# EAGLE design RTR_2T_LCD_CCS (EAGLE 7.2.0)
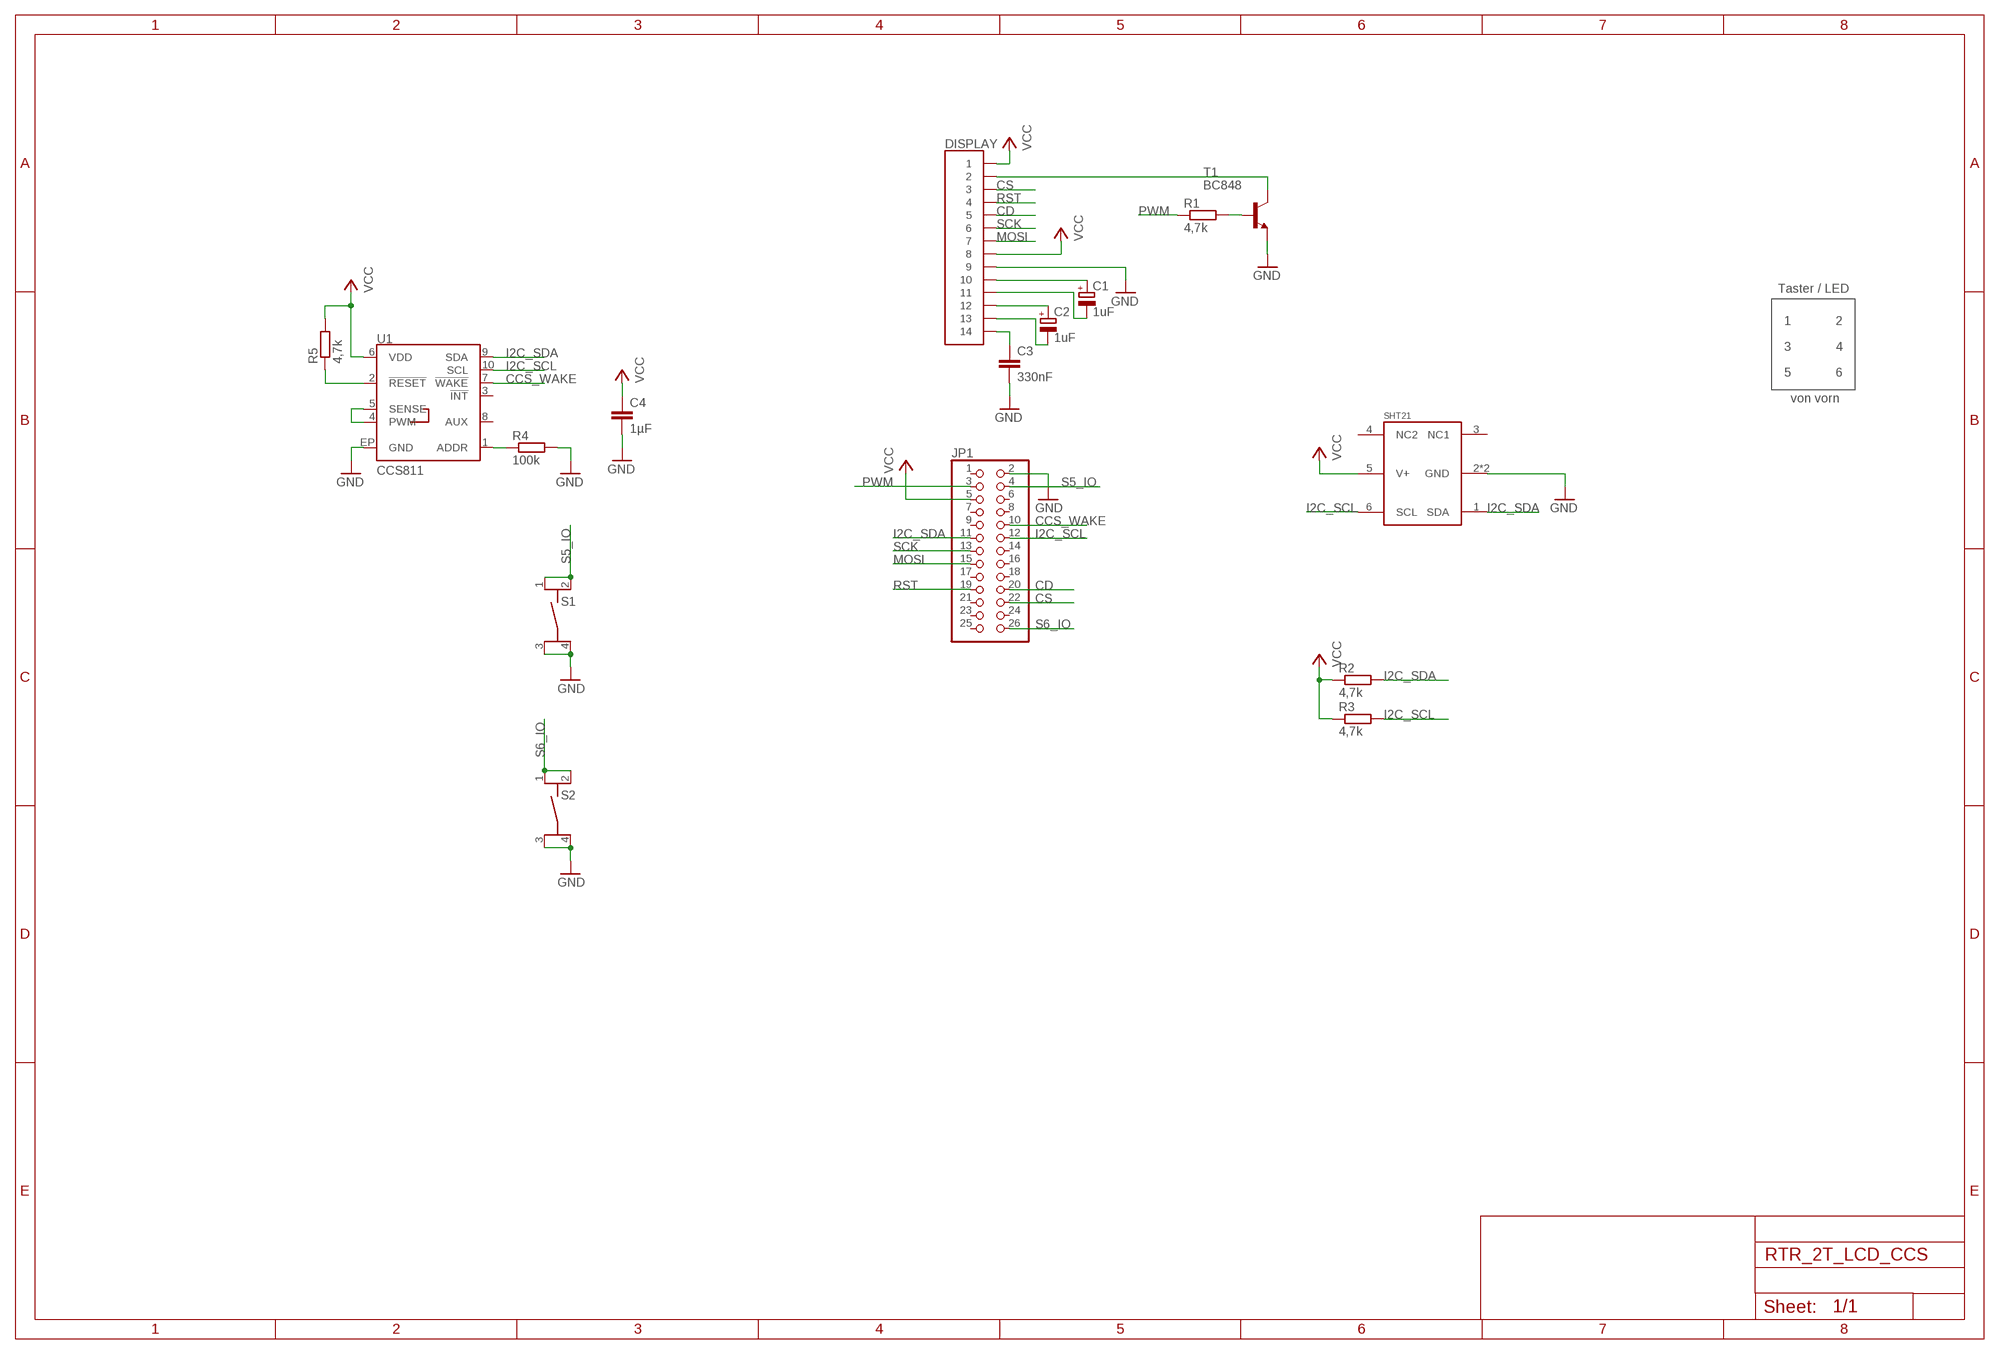
[diagram p0: schematic, sheet 1]

## Parts
C1  1uF  CPOL-EU153CLV-0405  [153CLV-0405]
C2  1uF  CPOL-EU153CLV-0405  [153CLV-0405]
C3  330nF  C-EUC0805  [C0805]
C4  1µF  C-EUC0805  [C0805]
DISPLAY  FFC-14  [14-POLIG]
JP1  PINHD-2X13_2.54-SMD  [2X13SMD]
R1  4,7k  R-EU_R0805  [R0805]
R2  4,7k  R-EU_R0805  [R0805]
R3  4,7k  R-EU_R0805  [R0805]
R4  100k  R-EU_R0805  [R0805]
R5  4,7k  R-EU_R0805  [R0805]
S1  TASTER_9314SMD  [TASTER_9314]
S2  TASTER_9314SMD  [TASTER_9314]
SHT21  SHT21  [SHT21]
T1  BC848  [SOT23]
U1  CCS811  [LGA10]

## Nets
CCS_WAKE: JP1.10 U1.7(!WAKE!)
CD: DISPLAY.5 JP1.20
CS: DISPLAY.3 JP1.22
GND: C3.2 C4.2 DISPLAY.9 JP1.2 R4.2 S1.3 S1.4 S2.3 S2.4 SHT21.2(GND) SHT21.P$1(GND) T1.2(E) U1.EP(GND)
I2C_SCL: JP1.12 R3.2 SHT21.6(SCL) U1.10(SCL)
I2C_SDA: JP1.11 R2.2 SHT21.1(SDA) U1.9(SDA)
MOSI: DISPLAY.7 JP1.15
N$1: C1.+ DISPLAY.10
N$2: C1.- DISPLAY.11
N$3: C2.+ DISPLAY.12
N$4: C2.- DISPLAY.13
N$5: C3.1 DISPLAY.14
N$7: U1.4(PWM) U1.5(SENSE)
N$8: DISPLAY.2 T1.3(C)
N$9: R1.2 T1.1(B)
N$10: R4.1 U1.1(ADDR)
N$12: R5.1 U1.2(!RESET!)
PWM: JP1.3 R1.1
RST: DISPLAY.4 JP1.19
S5_IO: JP1.4 S1.1 S1.2
S6_IO: JP1.26 S2.1 S2.2
SCK: DISPLAY.6 JP1.13
VCC: C4.1 DISPLAY.1 DISPLAY.8 JP1.5 R2.1 R3.1 R5.2 SHT21.5(V+) U1.6(VDD)
Unconnected: JP1.1 JP1.6 JP1.7 JP1.8 JP1.9 JP1.14 JP1.16 JP1.17 JP1.18 JP1.21 JP1.23 JP1.24 JP1.25 SHT21.3(NC1) SHT21.4(NC2) U1.3(!INT!) U1.8(AUX)

## Notes on the sheet
- Taster / LED
- 1 | 2
- 3 | 4
- 5 | 6
- von vorn

## Library data of the parts
C1 C2 = rcl:CPOL-EU: POLARIZED CAPACITOR, European symbol
C3 C4 = rcl:C-EU: CAPACITOR, European symbol
DISPLAY = jt-con-molex:FFC-14
JP1 = pinhead_uc_forum:PINHD-2X13: PIN HEADER
R1-R5 = rcl:R-EU_: RESISTOR, European symbol
S1 S2 = switch:TASTER_9314
SHT21 = SHT21:SHT21: Tempsensor RS No: 709-8868 MRF No: TMP112AIDRLT
T1 = transistor:BC848: NPN TRANSISTOR
U1 = CCS811_Breakout_Temp:CCS811: AMS CCS811 – I2C Digital Gas Sensor Ultra-Low Power Digital Gas Sensor for Monitoring Indoor Air Quality AMS Product Page <http://ams.com/eng/Products/Environmental-Sensors/Gas-Sensors/CCS811> SparkFun Products:; PROD_ID: IC-13607

## Board
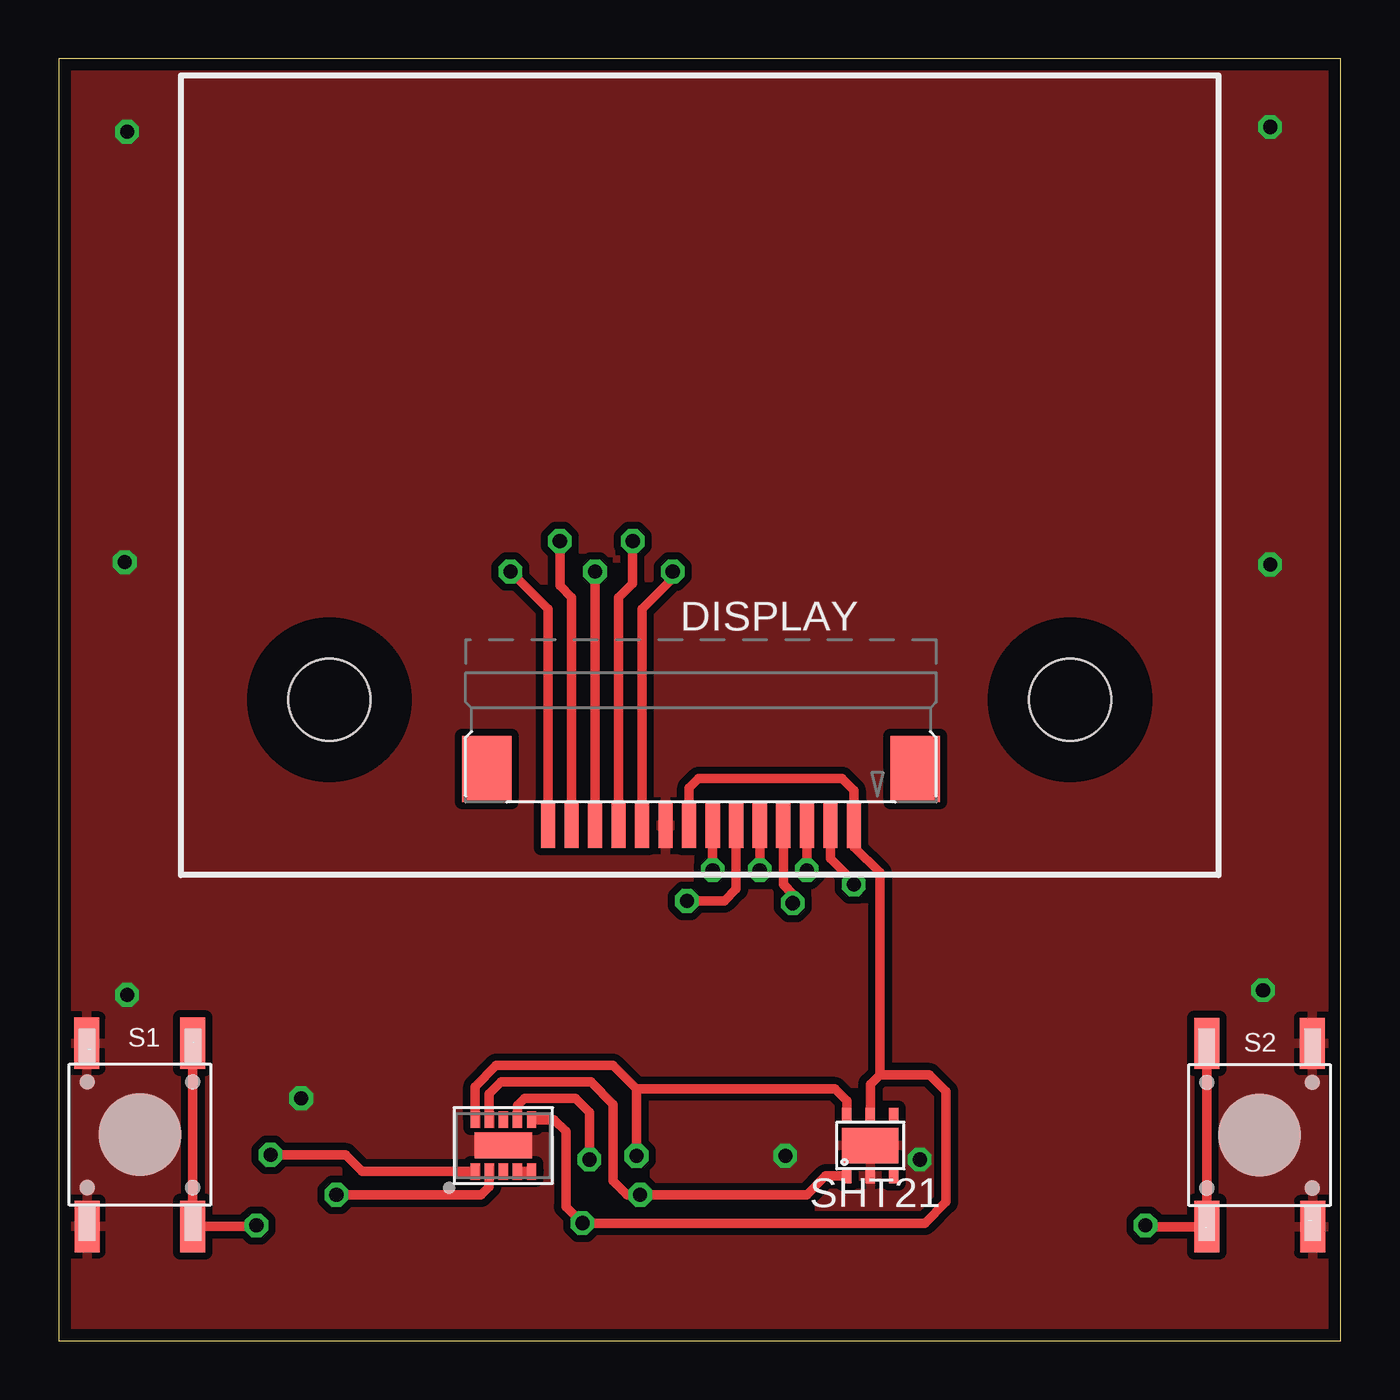
[diagram p1: board, top side]
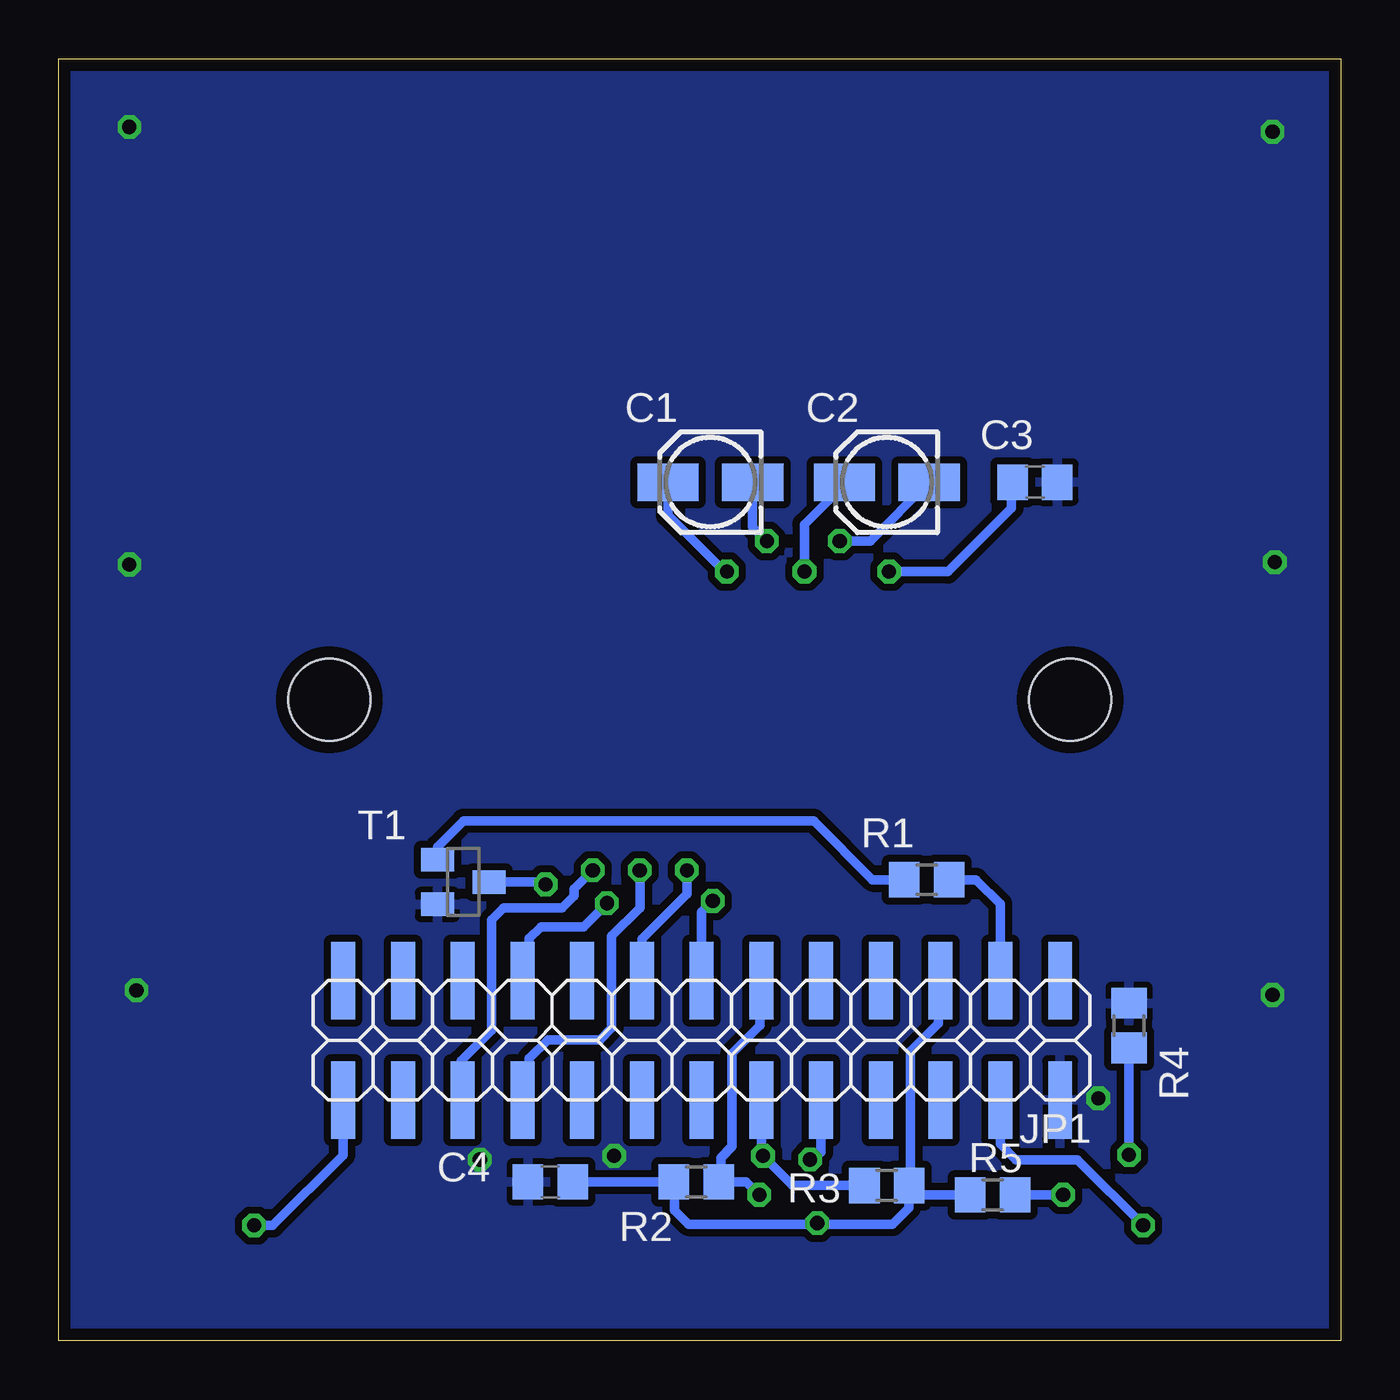
[diagram p2: board, bottom side, seen from below]

Size 54.5 x 54.5 mm. Coordinates in mm from the lower left corner, seen from the top.
Outline: 0,0 54.5,0 54.5,54.5 0,54.5 0,0
Copper layers (1*16): Top 0.035mm / dielectric 1.5mm / Bottom 0.035mm
Design rules "bilex-lp *": minimum track width 10mil, minimum drill 0.4mm, track to track 8mil, track to pad 8mil, pad to pad 8mil, via to via 8mil, smd to smd 10mil, copper to edge 20mil, drill to drill 8mil, minimum pad ring 10mil, minimum via ring 8mil, stop-mask expansion 4mil, vias tented up to drill 0.7mm, thermal gap 10mil
Holes 3.5 mm at 11.5,27.25 43,27.25
tKeepout: area 0,34.5 to 54.5,38.5; area 0,16 to 54.5,20; area 0,52.5 to 54.5,54.5; area 0,0 to 54.5,2; area 23.6,-0.2 to 30.1,54.3
bKeepout: area 7.8,23.5 to 15.2,31; area 39.2,23.5 to 46.8,31; area -0.5,-0.5 to 4.5,55.5; area -0.5,50 to 55,55.5; area 50,-0.5 to 55,55.5; area -0.5,-0.5 to 55,4.5; area -0.5,24 to 55,30.5
tRestrict: area 9,24.8 to 14,29.7; area 40.5,24.8 to 45.5,29.7

### Footprints (pad centres in the part's own frame; a part is rotated, then mirrored left to right if it is on the bottom)
153CLV-0405 = smd 2.6 x 1.6: + 1.8,0; - -1.8,0
C0805 = smd 1.3 x 1.5: 1 -0.95,0; 2 0.95,0
14-POLIG = smd 0.6 x 1.9: 1 -6.5,1; 2 -5.5,1; 3 -4.5,1; 4 -3.5,1; 5 -2.5,1; 6 -1.5,1; 7 -0.5,1; 8 0.5,1; 9 1.5,1; 10 2.5,1; 11 3.5,1; 12 4.5,1; 13 5.5,1; 14 6.5,1 | smd 2.1 x 2.8: P$1 -9.1,-1.4; P$2 9.1,-1.4
2X13SMD = smd 1.016 x 3.302: 1 -1.27,-3.81; 2 -1.27,1.27; 3 1.27,-3.81; 4 1.27,1.27; 5 3.81,-3.81; 6 3.81,1.27; 7 6.35,-3.81; 8 6.35,1.27; 9 8.89,-3.81; 10 8.89,1.27; 11 11.43,-3.81; 12 11.43,1.27; 13 13.97,-3.81; 14 13.97,1.27; 15 16.51,-3.81; 16 16.51,1.27; 17 19.05,-3.81; 18 19.05,1.27; 19 21.59,-3.81; 20 21.59,1.27; 21 24.13,-3.81; 22 24.13,1.27; 23 26.67,-3.81; 24 26.67,1.27; 25 29.21,-3.81; 26 29.21,1.27
R0805 = smd 1.3 x 1.5: 1 -0.95,0; 2 0.95,0
TASTER_9314 = smd 2.184 x 1.067: 1 -3.9,2.29; 2 3.89,2.3; 3 -3.9,-2.21; 4 3.89,-2.2
SHT21 = smd 0.4 x 0.6: 1 -1,-1.3; 2 0,-1.3; 3 1,-1.3; 4 1,1.3; 5 0,1.3; 6 -1,1.3 | smd 2.4 x 1.5: P$1 0,0
SOT23 = smd 1 x 1.4: 1 -0.95,-1.1; 2 0.95,-1.1; 3 0,1.1
LGA10 = smd 0.7 x 0.4: 1 -1.1,1.2; 2 -1.1,0.6; 3 -1.1,0; 4 -1.1,-0.6; 5 -1.1,-1.2; 6 1.1,-1.2; 7 1.1,-0.6; 8 1.1,0; 9 1.1,0.6; 10 1.1,1.2 | smd 1.1 x 2.45: EP 0,0

### Placement (x,y rotation side)
C1  26.8,36.5 180 bottom
C2  19.3,36.5 180 bottom
C3  13,36.5 0 bottom
C4  33.6,6.76 180 bottom
DISPLAY  27.3,22.9 180 top
JP1  13.2,11.5 180 bottom
R1  17.6,19.6 180 bottom
R2  27.4,6.76 0 bottom
R3  19.3,6.6 180 bottom
R4  9,13.4 90 bottom
R5  14.8,6.2 180 bottom
S1  3.4,8.75 270 top
S2  51.1,8.75 90 top
SHT21  34.5,8.3 0 top
T1  37.3,19.5 270 bottom
U1  18.9,8.3 90 top

### Tracks (layer width: path | path; a pad name or v marks a point on that pad's centre or on a via)
CCS_WAKE  (via drill 0.6)
  Top 0.406: U1.7 19.5,10 19.8,10.3 21.96,10.3 22.56,9.7 v22.56,7.7
  Bottom 0.406: JP1.10 22.09,8.01 v22.56,7.7
CD  (via drill 0.6)
  Top 0.406: DISPLAY.5 v29.8,20
  Bottom 0.406: v29.8,20 29.8,18.4 31,17.2 31,13.3 31.5,12.8 33.7,12.8 34.5,12 34.5,10.14 JP1.20
CS  (via drill 0.6)
  Top 0.406: DISPLAY.3 v31.8,20
  Bottom 0.406: v31.8,20 32.6,19.2 32.6,18.9 33.1,18.4 35.6,18.4 36.1,17.9 36.1,13.2 37.4,11.9 37.4,9.86 JP1.22
GND  (via drill 0.6)
  other vias: 10.3,10.3 51.2,14.9 51.5,33 2.8,33.1 2.9,51.4 51.5,51.6 2.9,14.7 30.89,7.86 36.6,7.7
  pour Bottom (isolate 0.305): 0,0 0,54.5 54.4,54.5 54.5,54.5 54.5,0
  pour Top (isolate 0.305): 0.1,0 0.1,54.5 54.4,54.5 54.5,54.5 54.5,0
I2C_SCL  (via drill 0.6)
  Top 0.406: SHT21.6 33.5,10.2 33,10.7 24.56,10.7 | U1.10 17.7,10.8 18.6,11.7 23.56,11.7 24.56,10.7 | 24.56,10.7 v24.56,7.86
  Bottom 0.406: R3.2 23.3,6.6 v24.56,7.86 24.63,7.93 JP1.12
I2C_SDA  (via drill 0.6)
  Top 0.406: SHT21.1 32.6,7 31.8,6.2 v24.72,6.2 24.16,6.2 23.56,6.8 23.56,10.06 22.62,11 18.8,11 18.3,10.5 U1.9
  Bottom 0.406: v24.72,6.2 25.28,6.76 R2.2 26.35,6.7 26.35,7.78 25.88,8.26 25.88,12.22 24.7,13.4 24.7,13.5 24.6,15.38 JP1.11
MOSI  (via drill 0.6)
  Top 0.406: DISPLAY.7 v27.8,20
  Bottom 0.406: 27.8,19.9 v27.8,20 27.8,19 29.71,17.09 JP1.15
N$1  (via drill 0.6)
  Top 0.406: DISPLAY.10 24.8,31.1 26.1,32.4 v26.1,32.7
  Bottom 0.406: 26.2,32.7 28.6,35.1 C1.+
  Bottom 0.61: v26.1,32.7 26.2,32.7
N$2  (via drill 0.6)
  Top 0.406: DISPLAY.11 23.8,31.6 24.4,32.2 v24.4,34
  Bottom 0.406: C1.- 25,34.6 v24.4,34
N$3  (via drill 0.6)
  Top 0.406: DISPLAY.12 v22.8,32.7
  Bottom 0.406: 21.1,36.4 22.8,34.7 v22.8,32.7
  Bottom 0.61: C2.+ 21.1,36.4
N$4  (via drill 0.6)
  Top 0.406: DISPLAY.13 21.8,31.6 21.3,32.1 v21.3,34
  Bottom 0.406: v21.3,34 20,34 C2.-
N$5  (via drill 0.6)
  Top 0.406: DISPLAY.14 20.8,31.1 v19.2,32.7
  Bottom 0.406: v19.2,32.7 16.7,32.7 14,35.4 14,36.45 C3.1
N$7
  Top 0.406: U1.4 U1.5
N$8  (via drill 0.6)
  Top 0.406: DISPLAY.2 32.8,20.5 33.8,19.5 v33.8,19.4
  Bottom 0.406: T1.3 34.1,19.5 v33.8,19.4
N$9
  Bottom 0.406: T1.1 38.4,21 37.3,22.1 22.4,22.1 19.9,19.6 R1.2
N$10  (via drill 0.6)
  Top 0.406: U1.1 12.9,7.2 12.2,7.9 v9,7.9
  Bottom 0.406: v9,7.9 R4.1
N$12  (via drill 0.6)
  Top 0.406: v11.8,6.2 17.95,6.2 18.3,6.55 U1.2
  Bottom 0.406: R5.1 v11.8,6.2
PWM
  Bottom 0.406: JP1.3 14.47,18.57 15.5,19.6 R1.1
RST  (via drill 0.6)
  Top 0.406: DISPLAY.4 30.8,19.4 31.2,19 v31.2,18.6
  Bottom 0.406: v31.2,18.6 32.2,17.6 34,17.6 34.5,17.1 34.5,15.22 JP1.19
S5_IO  (via drill 0.6)
  Top 0.406: S1.1 S1.2 | S1.2 8.36,4.86 v8.4,4.9
  Top 0.61: S1.2
  Bottom 0.406: JP1.4 14.47,8.37 13.8,7.7 11.2,7.7 v8.4,4.9
S6_IO  (via drill 0.6)
  Top 0.406: S2.2 S2.1 46.25,4.85 v46.2,4.9
  Top 0.61: S2.2
  Bottom 0.406: JP1.26 42.41,7.89 45.4,4.9 v46.2,4.9
SCK  (via drill 0.6)
  Top 0.406: DISPLAY.6 28.8,19.2 28.3,18.7 v26.7,18.7
  Bottom 0.406: JP1.13 27.17,18.23 v26.7,18.7
VCC  (via drill 0.6)
  Top 0.406: DISPLAY.8 26.8,23.5 27.2,23.9 33.3,23.9 33.8,23.4 DISPLAY.1 33.8,21 34.9,19.9 34.9,11.3 | 34.9,11.3 34.5,10.9 SHT21.5 | 34.9,11.3 37.02,11.3 37.72,10.6 37.72,5.9 36.82,5 v22.26,5 21.56,5.7 21.56,8.9 21.06,9.4 U1.6
  Bottom 0.406: JP1.5 17.11,13.49 18.3,12.3 18.3,6.65 R3.1 | C4.1 R2.1 28.33,5.55 27.73,4.95 22.05,4.95 | R3.1 18.35,5.65 19.05,4.95 22.05,4.95 | 22.05,4.95 v22.26,5 | R5.2 17.95,6.2 R3.1

### Text on the board
tDocu: TOP
bDocu: BOTTOM